# Altium schematic sheet Volant5.CAN_transceiver_1.0.SchDoc
size A
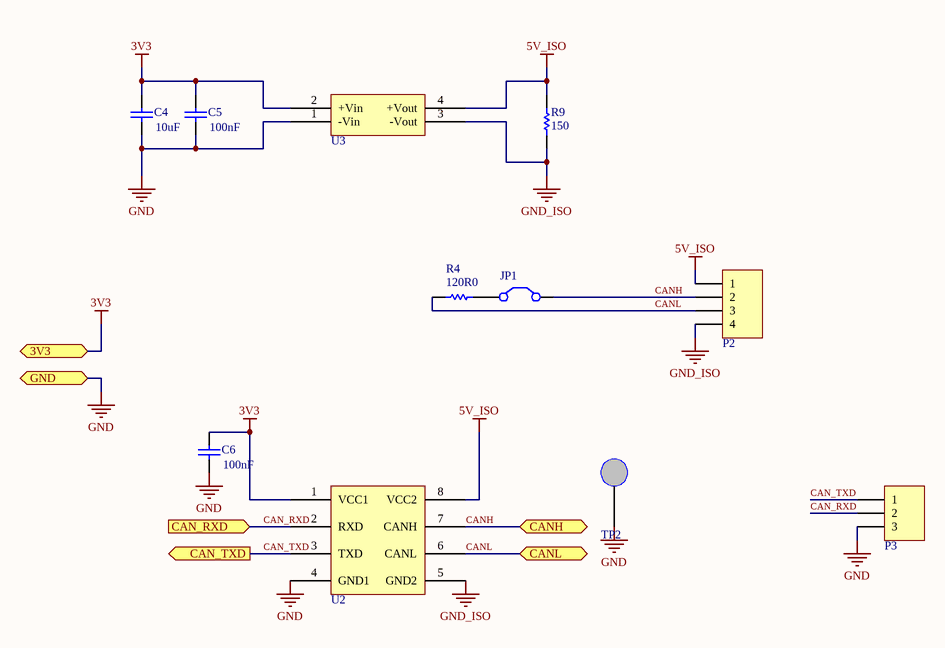
[diagram p0: Volant5.CAN_transceiver_1.0.SchDoc]

## Parts
C4  value 10uF  [CS-0603]  (hidden comment: CS - CAPACITOR)
C5  value 100nF  [CS-0603]  (hidden comment: CS - CAPACITOR)
C6  value 100nF  [CS-0603]  (hidden comment: CS - CAPACITOR)
JP1  JMP - Jumper  [HEADER-2-JMP]  (value not drawn)
P2  CON - HEADER 1X4  [CON-HEADER-1X4]  (value not drawn)
P3  CON - HEADER 1X3  [CON-HEADER-1X3]  (value not drawn)
R4  value 120R0  [RS-0603]  (hidden comment: RS - RESISTOR)
R9  value 150  [RS-0603]  (hidden comment: RS - RESISTOR)
TP2  5003K  [TP - VERTICAL]  (value not drawn)
U2  IC - ISO1050  [IC-SOP-8]  (value not drawn)
U3  IC - CME0305S3C  [IC-SIP-4]  (value not drawn)

## Ports
3V3, CAN_RXD (in), CAN_TXD (out), CANH (bidir), CANL (bidir), GND

## Nets
3V3: C4.2 C5.2 C6.2 U2.1(VCC1) U3.2(+Vin) ; port 3V3
5V_ISO: P2.1 R9.2 U2.8(VCC2) U3.4(+Vout)
GND: C4.1 C5.1 C6.1 P3.3 TP2.1 U2.4(GND1) U3.1(-Vin) ; port GND
GND_ISO: P2.4 R9.1 U2.5(GND2) U3.3(-Vout)
CAN_RXD: P3.2 U2.2(RXD) ; port CAN_RXD
CAN_TXD: P3.1 U2.3(TXD) ; port CAN_TXD
CANH: JP1.2(C2) P2.2 U2.7(CANH) ; port CANH
CANL: P2.3 R4.2 U2.6(CANL) ; port CANL
NetJP1_1: JP1.1(C1) R4.1

## Library data of the parts
C4-C6 = CS - CAPACITOR: TOLERANCE: 10%; Supplier 1: *; (FIELD A): *; (FLIED C): *; (FIELD B): *; Manufacturer: *
  C4: Supplier Part Number 1: 587-3238-1-ND
  C5 C6: Supplier Part Number 1: 490-1532-1-ND
JP1 = JMP - Jumper: Jumper; Supplier Part Number 1: *; Supplier 1: *; Manufacturer: *; (FIELD A): *; (FIELD B): *; (FIELD C): *
P2 = CON - HEADER 1X4: 100mil header 1 row 4pins; Manufacturer: *; (FIELD A): *; (FIELD B): *; (FIELD C): *; Supplier 1: Digi-Key; Supplier Part Number 1: S1011EC-04-ND
P3 = CON - HEADER 1X3: 100mil header 1 row 3pins; Manufacturer: *; (FIELD A): *; (FIELD B): *; (FIELD C): *; Supplier 1: Digi-Key; Supplier Part Number 1: S1212EC-03-ND
R4 R9 = RS - RESISTOR: TOLERANCE: RES TOL; POWER: RES POWER; Supplier 1: *; (FIELD A): *; (FLIED C): *; (FIELD B): *; Manufacturer: *
  R4: Supplier Part Number 1: *
  R9: Supplier Part Number 1: RHM150CFCT-ND
TP2 = TP - Test point vertical: (FIELD A): *; (FIELD B): *; (FIELD C): *; Manufacturer: *; Supplier 1: Newark; Supplier Part Number 1: 62W5140
U2 = IC - ISO1050: Isolated CAN transceiver; Manufacturer: Texas Instrument; (FIELD A): *; (FIELD B): *; (FIELD C): *; Supplier 1: Digi-Key; Supplier Part Number 1: 296-24818-1-ND
U3 = IC - CME0305S3C: Supplier 1: Digi-Key; Supplier Part Number 1: 811-2890-5-ND; Manufacturer: *; (FIELD A): *; (FIELD B): *; (FIELD C): *